# EAGLE design ArduIRv2 (EAGLE 7.2.0)
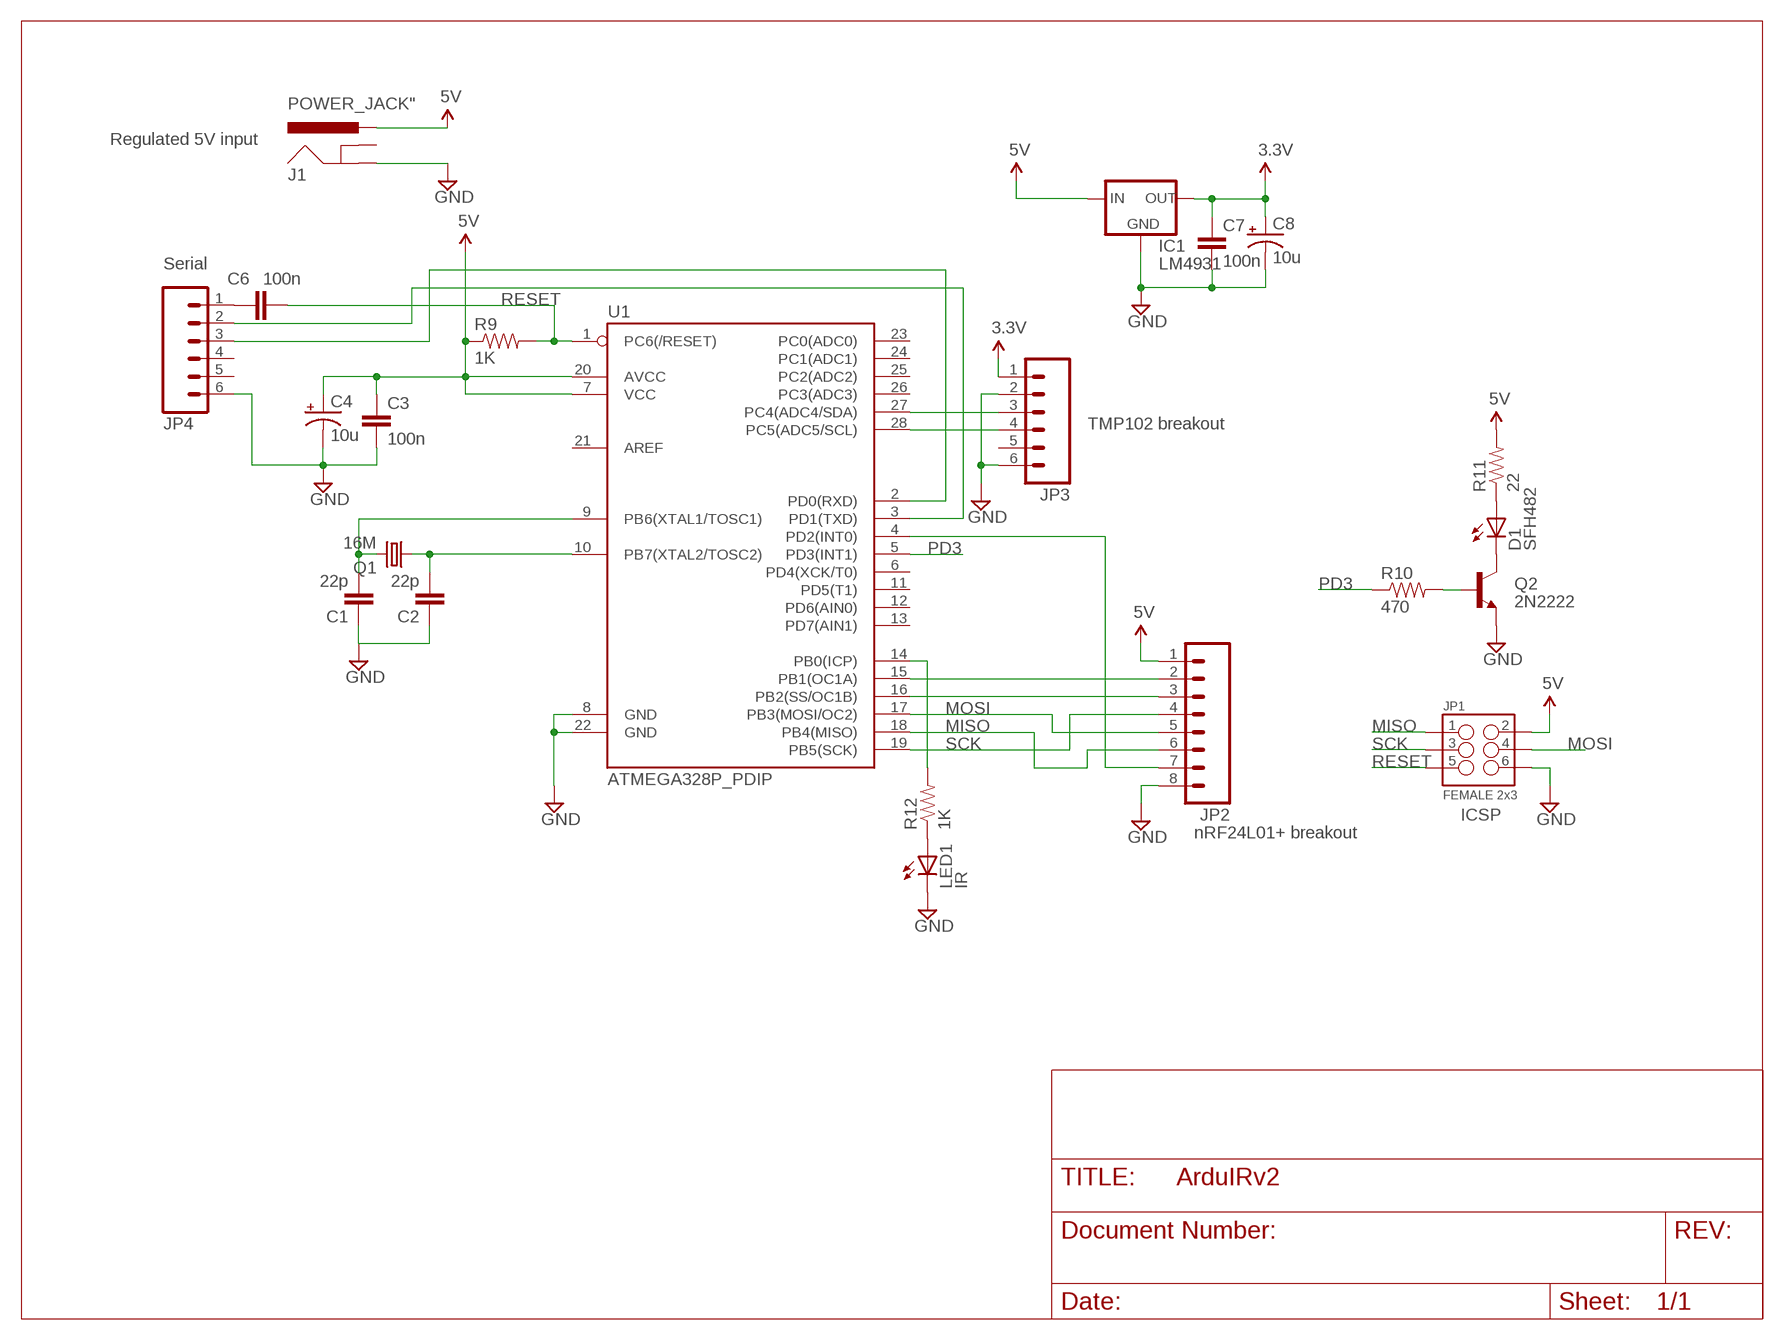
[diagram p0: schematic, sheet 1]

## Parts
C1  22p  CAPPTH  [CAP-PTH-SMALL]
C2  22p  CAPPTH  [CAP-PTH-SMALL]
C3  100n  0.1UF-50V-20%(PTH)KIT-EZ  [CAP-PTH-SMALL-KIT]
C4  10u  CAP_POLPTH2  [CPOL-RADIAL-10UF-25V]
C6  100n  0.1UF-50V-20%(PTH)KIT-EZ  [CAP-PTH-SMALL-KIT]
C7  100n  0.1UF-50V-20%(PTH)KIT-EZ  [CAP-PTH-SMALL-KIT]
C8  10u  CAP_POLPTH2  [CPOL-RADIAL-10UF-25V]
D1  SFH482  [SFH482]
IC1  LM4931  REGULATORTO220  [L4931_REGULATOR]
J1  POWER_JACK"  [POWER_JACK]
JP1  FEMALE 2x3  M03X2SHROUD  [2X3-SHROUDED]
JP2  M08SILK_FEMALE_PTH  [1X08]
JP3  M06SILK_FEMALE_PTH  [1X06]
JP4  M06SILK_FEMALE_PTH  [1X06]
LED1  IR  LED5MM  [LED5MM]
Q1  16M  CRYSTALHC49US  [HC49US]
Q2  2N2222  TRANSISTOR_NPNTO-92-AMMO  [TO-92-AMMO]
R9  1K  1KOHM-1/4W-1%(PTH)VERT-KIT  [AXIAL-0.1EZ]
R10  470  1KOHM-1/4W-1%(PTH)VERT-KIT  [AXIAL-0.1EZ]
R11  22  1KOHM-1/4W-1%(PTH)VERT-KIT  [AXIAL-0.1EZ]
R12  1K  10KOHM-1/4W-1%(PTH)VERT-KIT  [AXIAL-0.1EZ]
U1  ATMEGA328P_PDIP  [DIL28-3]

## Nets
3.3V: C7.1 C8.1(+) IC1.OUT JP3.1
5V: C3.1 C4.1(+) IC1.IN J1.PWR JP1.2 JP2.1 R9.P$1 R11.P$2 U1.7(VCC) U1.20(AVCC)
GND: C1.1 C2.1 C3.2 C4.2(-) C7.2 C8.2(-) IC1.GND J1.GND JP1.6 JP2.8 JP3.2 JP3.6 JP4.6 LED1.K(C) Q2.1(E) U1.8(GND) U1.22(GND)
MISO: JP1.1 JP2.6 U1.18(PB4(MISO))
MOSI: JP1.4 JP2.5 U1.17(PB3(MOSI/OC2))
N$1: JP2.2 U1.15(PB1(OC1A))
N$2: JP2.3 U1.16(PB2(SS/OC1B))
N$3: R12.P$2 U1.14(PB0(ICP))
N$4: JP2.7 U1.4(PD2(INT0))
N$10: C1.2 Q1.2 U1.9(PB6(XTAL1/TOSC1))
N$11: C2.2 Q1.1 U1.10(PB7(XTAL2/TOSC2))
N$13: JP3.3 U1.27(PC4(ADC4/SDA))
N$14: JP3.4 U1.28(PC5(ADC5/SCL))
N$15: Q2.2(B) R10.P$2
N$16: D1.K(C) Q2.3(C)
N$17: D1.A R11.P$1
N$18: LED1.A R12.P$1
N$22: C6.2 JP4.1
N$23: JP4.2 U1.3(PD1(TXD))
N$24: JP4.3 U1.2(PD0(RXD))
PD3: R10.P$1 U1.5(PD3(INT1))
RESET: C6.1 JP1.5 R9.P$2 U1.1(PC6(/RESET))
SCK: JP1.3 JP2.4 U1.19(PB5(SCK))
Unconnected: J1.GNDBREAK JP3.5 JP4.4 JP4.5 U1.6(PD4(XCK/T0)) U1.11(PD5(T1)) U1.12(PD6(AIN0)) U1.13(PD7(AIN1)) U1.21(AREF) U1.23(PC0(ADC0)) U1.24(PC1(ADC1)) U1.25(PC2(ADC2)) U1.26(PC3(ADC3))

## Notes on the sheet
- Regulated 5V input
- Serial
- TMP102 breakout
- ICSP
- nRF24L01+ breakout

## Library data of the parts
C1 C2 = SparkFun-Capacitors:CAP: Capacitor Standard 0603 ceramic capacitor, and 0.1" leaded capacitor.
C3 C6 C7 = SparkFun-Capacitors:0.1UF-50V-20%(PTH): CAP-08370; PROD_ID: CAP-08370
C4 C8 = SparkFun-Capacitors:CAP_POL: Capacitor Polarized These are standard SMD and PTH capacitors. Normally 10uF, 47uF, and 100uF in electrolytic and tantalum varieties. Always verify the external diameter of the through hole cap, it varies with capacity, voltage, and manufacturer. The EIA devices should be standard.
D1 = led:SFH482: IR LED infrared emitting diode, Infineon
IC1 = RBBB:REGULATOR: VOLTAGE REGULATOR
J1 = RBBB:POWER_JACK: Power Jack This is the standard 5.5mm barrel jack for power. The PTH is the most common, proven, reliable, footprint. All others are experimental. The Slot footprint only works if the mill layer is transmitted to the PCB fab house so be warned. Spark Fun Electronics SKU : PRT-00119. Mating wall wart : TOL-00298 (and others)
JP1 = SparkFun-Connectors:M03X2: 2x3 .1" header. Shrouded, with keying- CONN-10681 SMT- CONN-11415 Pogo pins- HW-11044; PROD_ID: CONN-10681
JP2 = SparkFun-Connectors:M08: Header 8 Standard 8-pin 0.1" header. Use with straight break away headers (SKU : PRT-00116), right angle break away headers (PRT-00553), swiss pins (PRT-00743), machine pins (PRT-00117), and female headers (PRT-00115).; PROD_ID: CONN-08438
JP3 JP4 = SparkFun-Connectors:M06: Header 6 Standard 6-pin 0.1" header. Use with straight break away headers (SKU : PRT-00116), right angle break away headers (PRT-00553), swiss pins (PRT-00743), machine pins (PRT-00117), and female headers (PRT-00115). Molex polarized connector foot print use with SKU : PRT-08094 with associated crimp pins and housings. NOTES ON THE VARIANTS LOCK and LOCK_LONGPADS... This footprint was designed to help hold the alignment of a through-hole component (i.e. 6-pin header) while soldering it into place. You may notice that each hole has been shifted either up or down by 0.005 of an inch from it's more standard position (which is a perfectly straight line). This slight alteration caused the pins (the squares in the middle) to touch the edges of the holes. Because they are alternating, it causes a "brace" to hold the component in place. 0.005 has proven to be the perfect amount of "off-center" position when using our standard breakaway headers. Although looks a little odd when you look at the bare footprint, once you have a header in there, the alteration is very hard to notice. Also,if you push a header all the way into place, it is covered up entirely on the bottom side. This idea of altering the position of holes to aid alignment will be further integrated into the Sparkfun Library for other footprints. It can help hold any component with 3 or more connection pins.; PROD_ID: CONN-08437
LED1 = led:LED: LED OSRAM: - CHIPLED LG R971, LG N971, LY N971, LG Q971, LY Q971, LO R971, LY R971 LH N974, LH R974 LS Q976, LO Q976, LY Q976 LO Q996 - Hyper CHIPLED LW Q18S LB Q993, LB Q99A, LB R99A - SideLED LS A670, LO A670, LY A670, LG A670, LP A670 LB A673, LV A673, LT A673, LW A673 LH A674 LY A675 LS A676, LA A676, LO A676, LY A676, LW A676 LS A679, LY A679, LG A679 - Hyper Micro SIDELED® LS Y876, LA Y876, LO Y876, LY Y876 LT Y87S - SmartLED LW L88C, LW L88S LB L89C, LB L89S, LG L890 LS L89K, LO L89K, LY L89K LS L896, LA L896, LO L896, LY L896 - TOPLED LS T670, LO T670, LY T670, LG T670, LP T670 LSG T670, LSP T670, LSY T670, LOP T670, LYG T670 LG T671, LOG T671, LSG T671 LB T673, LV T673, LT T673, LW T673 LH T674 LS T676, LA T676, LO T676, LY T676, LB T676, LH T676, LSB T676, LW T676 LB T67C, LV T67C, LT T67C, LS T67K, LO T67K, LY T67K, LW E67C LS E67B, LA E67B, LO E67B, LY E67B, LB E67C, LV E67C, LT E67C LW T67C LS T679, LY T679, LG T679 LS T770, LO T770, LY T770, LG T770, LP T770 LB T773, LV T773, LT T773, LW T773 LH T774 LS E675, LA E675, LY E675, LS T675 LS T776, LA T776, LO T776, LY T776, LB T776 LHGB T686 LT T68C, LB T68C - Hyper Mini TOPLED® LB M676 - Mini TOPLED Santana® LG M470 LS M47K, LO M47K, LY M47K Source: http://www.osram.convergy.de LUXEON: - LUMILED® LXK2-PW12-R00, LXK2-PW12-S00, LXK2-PW14-U00, LXK2-PW14-V00 LXK2-PM12-R00, LXK2-PM12-S00, LXK2-PM14-U00 LXK2-PE12-Q00, LXK2-PE12-R00, LXK2-PE12-S00, LXK2-PE14-T00, LXK2-PE14-U00 LXK2-PB12-K00, LXK2-PB12-L00, LXK2-PB12-M00, LXK2-PB14-N00, LXK2-PB14-P00, LXK2-PB14-Q00 LXK2-PR12-L00, LXK2-PR12-M00, LXK2-PR14-Q00, LXK2-PR14-R00 LXK2-PD12-Q00, LXK2-PD12-R00, LXK2-PD12-S00 LXK2-PH12-R00, LXK2-PH12-S00 LXK2-PL12-P00, LXK2-PL12-Q00, LXK2-PL12-R00 Source: www.luxeon.com KINGBRIGHT: KA-3528ASYC Source: www.kingbright.com
Q1 = SparkFun-FreqCtrl:CRYSTAL: Various standard crystals. Proven footprints.
Q2 = SparkFun-DiscreteSemi:TRANSISTOR_NPN: Generic NPN BJT MMBT2222A - TRANS-08049 (SOT-23, 1A 40V) MPSA42 - TRANS-09116 (SOT-23, 500mA 300V) MMBT5088LT1G - TRANS-11160 (SOT-23, 50 mA 30V) BC547 - COM-08928 <http://www.sparkfun.com/products/8928> (TO-92 45V 100mA) (1.Collector 2.Base 3.Emitter) 2N3904 - COM-00521 <http://www.sparkfun.com/products/521> (TO-92 40V 200mA) (1.Emitter 2.Base 3.Collector) P2N2222A - COM-12852 <http://www.sparkfun.com/products/12852> (TO-92 40V 600mA) (1.Collector 2.Base 3.Emitter)
R9 = SparkFun-Resistors:1KOHM-1/4W-1%(PTH): RES-12182; PROD_ID: RES-12182
R10 R11 = SparkFun-Resistors:1KOHM-1/4W-1%(PTH): RES-12182; PROD_ID: RES-12182; VALUE: 1K
R12 = SparkFun-Resistors:10KOHM-1/4W-1%(PTH): RES-12183; PROD_ID: RES-12183; VALUE: 10k
U1 = SparkFun-DigitalIC:ATMEGA328P_PDIP: uC used in the Arduino 32kb flash, 1k EEPROM, 2k SRAM This is the through-hole version of this chip.

## Board
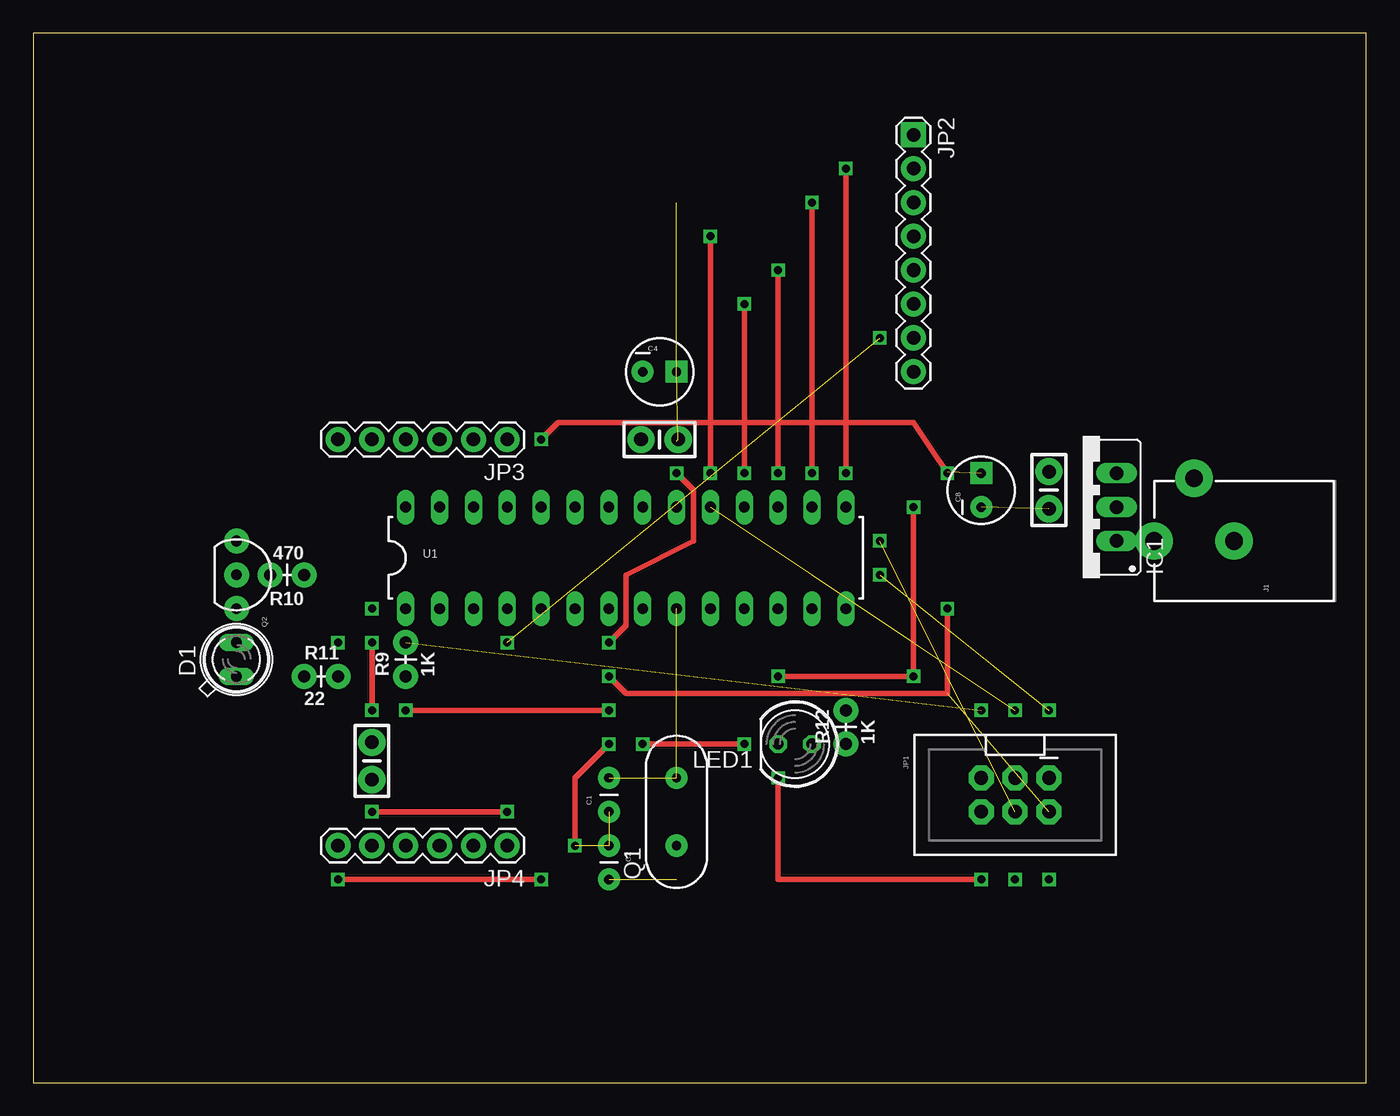
[diagram p1: board, top side]
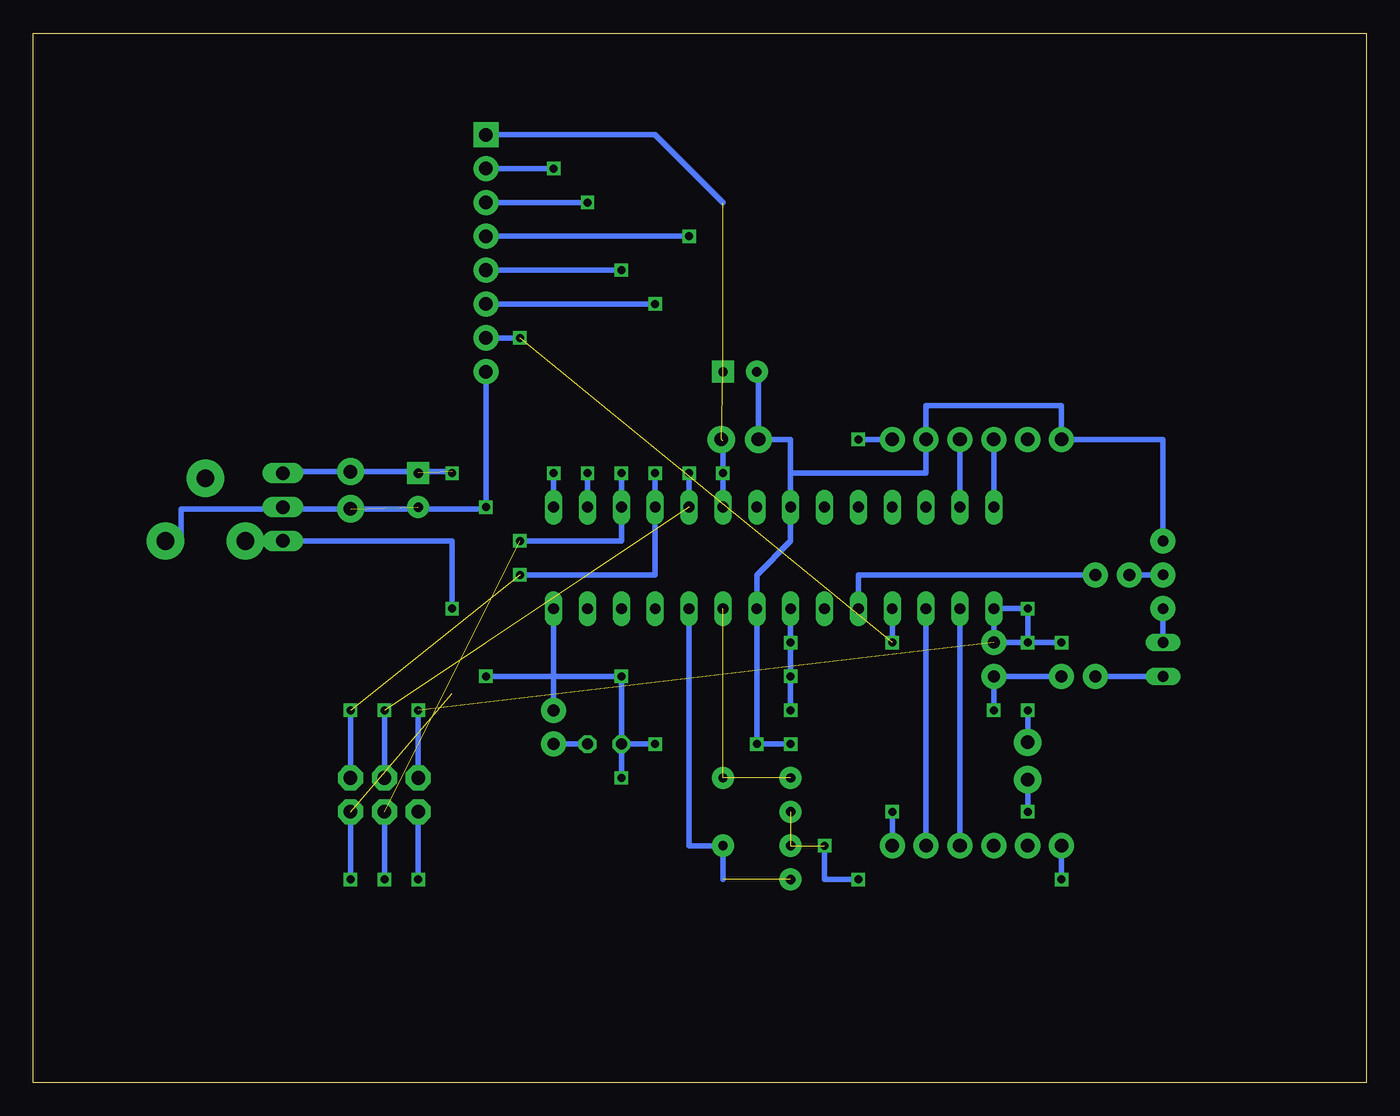
[diagram p2: board, bottom side, seen from below]

Size 100 x 78.73 mm. Coordinates in mm from the lower left corner, seen from the top.
Outline: 0,0 100,0 100,78.73 0,78.73 0,0
Copper layers (1*16): Top 0.035mm / dielectric 1.5mm / Bottom 0.035mm
Design rules "default": minimum track width 10mil, minimum drill 24mil, track to track 8mil, track to pad 8mil, pad to pad 8mil, via to via 8mil, smd to smd 8mil, copper to edge 40mil, drill to drill 8mil, minimum pad ring 10mil, minimum via ring 8mil, stop-mask expansion 4mil, vias tented up to drill 0mil, thermal gap 10mil

### Footprints (pad centres in the part's own frame; a part is rotated, then mirrored left to right if it is on the bottom)
CAP-PTH-SMALL = drill 0.7 pad 1.651: 1 0,0; 2 2.54,0
CAP-PTH-SMALL-KIT = drill 1.016 pad 2.032: 1 -1.397,0; 2 1.397,0
CPOL-RADIAL-10UF-25V = drill 0.7 pad 1.651 square: 1 1.27,0 | drill 0.7 pad 1.651: 2 -1.27,0
SFH482 = drill 0.813 long: A -1.27,0; K 1.27,0
L4931_REGULATOR = drill 1.016 long: GND 0,-2.54; IN -2.54,-2.54; OUT 2.54,-2.54
POWER_JACK = drill 1.321 pad 2.794: GND 0,7.7; GNDBREAK 4.7,10.7; PWR 0,13.7
2X3-SHROUDED = drill 1.016 pad 1.88 octagon: 1 -1.27,2.54; 2 1.27,2.54; 3 -1.27,0; 4 1.27,0; 5 -1.27,-2.54; 6 1.27,-2.54
1X08 = drill 1.016 pad 1.88 square: 1 0,0 | drill 1.016 pad 1.88: 2 2.54,0; 3 5.08,0; 4 7.62,0; 5 10.16,0; 6 12.7,0; 7 15.24,0; 8 17.78,0
1X06 = drill 1.016 pad 1.88: 1 0,0; 2 2.54,0; 3 5.08,0; 4 7.62,0; 5 10.16,0; 6 12.7,0
LED5MM = drill 0.813 octagon: A -1.27,0; K 1.27,0
HC49US = drill 0.7 pad 1.651: 1 -2.54,0; 2 2.54,0
TO-92-AMMO = drill 0.813 pad 1.88: 1 -2.54,0; 2 0,0; 3 2.54,0
AXIAL-0.1EZ = drill 0.9 pad 1.88: P$1 0,0; P$2 2.54,0
DIL28-3 = drill 0.813 long: 1 -16.51,-3.81; 2 -13.97,-3.81; 3 -11.43,-3.81; 4 -8.89,-3.81; 5 -6.35,-3.81; 6 -3.81,-3.81; 7 -1.27,-3.81; 8 1.27,-3.81; 9 3.81,-3.81; 10 6.35,-3.81; 11 8.89,-3.81; 12 11.43,-3.81; 13 13.97,-3.81; 14 16.51,-3.81; 15 16.51,3.81; 16 13.97,3.81; 17 11.43,3.81; 18 8.89,3.81; 19 6.35,3.81; 20 3.81,3.81; 21 1.27,3.81; 22 -1.27,3.81; 23 -3.81,3.81; 24 -6.35,3.81; 25 -8.89,3.81; 26 -11.43,3.81; 27 -13.97,3.81; 28 -16.51,3.81

### Placement (x,y rotation side)
C1  43.18,20.32 90 top
C2  43.18,17.78 270 top
C3  46.99,48.26 180 top
C4  46.99,53.34 0 top
C6  25.4,24.13 270 top
C7  76.2,44.45 270 top
C8  71.12,44.45 90 top
D1  15.24,31.75 90 top
IC1  78.74,43.18 90 top
J1  97.79,40.64 90 top
JP1  73.66,21.59 270 top
JP2  66.04,71.12 270 top
JP3  35.56,48.26 180 top
JP4  35.56,17.78 180 top
LED1  57.15,25.4 180 top
Q1  48.26,20.32 90 top
Q2  15.24,38.1 270 top
R9  27.94,30.48 90 top
R10  20.32,38.1 180 top
R11  20.32,30.48 0 top
R12  60.96,25.4 90 top
U1  44.45,39.37 0 top

### Tracks (layer width: path | path; a pad name or v marks a point on that pad's centre or on a via)
3.3V  (via drill 0.6)  (1 unrouted)
  Top 0.406: v68.58,45.72 66.04,49.53 39.37,49.53 v38.1,48.26
  Bottom 0.406: v38.1,48.26 JP3.1 | v68.58,45.72 68.58,45.85 C7.1 81.28,45.85 IC1.OUT
5V  (via drill 0.6)  (4 unrouted)
  Top 0.406: v43.18,27.94 v27.94,27.94 | v43.18,33.02 44.45,34.29 44.45,38.1 49.53,40.64 49.53,44.45 v48.26,45.72 | v43.18,30.48 44.45,29.21 68.58,29.21 v68.58,35.56
  Bottom 0.406: v43.18,27.94 v43.18,30.48 v43.18,33.02 U1.7 | v27.94,27.94 R9.P$1 R11.P$2 | 48.26,48.13 v48.26,45.72 U1.20 | J1.PWR IC1.IN 68.58,40.64 v68.58,35.56 | JP1.2 v76.2,15.24 | 48.26,66.04 53.34,71.12 JP2.1
GND  (via drill 0.6)  (3 unrouted)
  Top 0.406: v53.34,25.4 v45.72,25.4 | v43.18,25.4 40.64,22.86 v40.64,17.78 | v55.88,30.48 v66.04,30.48 v66.04,43.18 | v38.1,15.24 v22.86,15.24 | v55.88,22.86 55.88,15.24 v71.12,15.24
  Bottom 0.406: 43.18,45.72 33.02,45.72 JP3.2 33.02,50.8 22.86,50.8 JP3.6 15.24,48.26 Q2.1 | 43.18,45.72 U1.22 43.18,40.64 45.72,38.1 U1.8 v45.72,25.4 v43.18,25.4 | 45.72,48.26 C3.2 | C3.2 43.18,48.26 43.18,45.72 | v22.86,15.24 JP4.6 | C3.2 45.59,53.21 C4.2 | LED1.K v53.34,25.4 | LED1.K v55.88,30.48 | v38.1,15.24 40.64,15.24 v40.64,17.78 | JP1.6 v71.12,15.24 | LED1.K v55.88,22.86 v55.88,30.48 | JP2.8 v66.04,43.18 66.04,43.05 C7.2 81.28,43.05 | 81.28,43.05 IC1.GND | 81.28,43.05 88.9,43.05 88.9,40.64 J1.GND | v66.04,30.48 v55.88,30.48
MISO  (via drill 0.6)  (1 unrouted)
  Top 0.406: v53.34,58.42 v53.34,45.72
  Bottom 0.406: v63.5,38.1 53.34,38.1 U1.18 v53.34,45.72 | v76.2,27.94 JP1.1 | JP2.6 v53.34,58.42
MOSI  (via drill 0.6)  (1 unrouted)
  Top 0.406: v55.88,60.96 v55.88,45.72
  Bottom 0.406: v63.5,40.64 55.88,40.64 U1.17 v55.88,45.72 | v73.66,15.24 JP1.4 | JP2.5 v55.88,60.96
N$1  (via drill 0.6)
  Top 0.406: v60.96,68.58 v60.96,45.72
  Bottom 0.406: JP2.2 v60.96,68.58 | v60.96,45.72 U1.15
N$2  (via drill 0.6)
  Top 0.406: v58.42,66.04 v58.42,45.72
  Bottom 0.406: JP2.3 v58.42,66.04 | v58.42,45.72 U1.16
N$3
  Bottom 0.406: U1.14 R12.P$2
N$4  (via drill 0.6)  (1 unrouted)
  Bottom 0.406: JP2.7 v63.5,55.88 | U1.4 v35.56,33.02
N$10  (2 unrouted)
N$11  (1 unrouted)
  Bottom 0.406: U1.10 50.8,17.78 Q1.1 48.26,15.24
N$13
  Bottom 0.406: U1.27 JP3.3
N$14
  Bottom 0.406: JP3.4 U1.28
N$15
  Bottom 0.406: Q2.2 R10.P$2
N$16
  Bottom 0.406: D1.K Q2.3
N$17
  Bottom 0.406: R11.P$1 D1.A
N$18
  Bottom 0.406: LED1.A R12.P$1
N$22  (via drill 0.6)
  Top 0.406: v35.56,20.32 v25.4,20.32
  Bottom 0.406: JP4.1 v35.56,20.32 | v25.4,20.32 C6.2
N$23
  Bottom 0.406: JP4.2 U1.3
N$24
  Bottom 0.406: JP4.3 U1.2
PD3
  Bottom 0.406: R10.P$1 38.1,38.1 U1.5
RESET  (via drill 0.6)  (1 unrouted)
  Top 0.406: v25.4,27.94 v25.4,33.02
  Bottom 0.406: R9.P$2 U1.1 v25.4,35.56 v25.4,33.02 R9.P$2 | C6.1 v25.4,27.94 | R9.P$2 v22.86,33.02 | JP1.5 v71.12,27.94
SCK  (via drill 0.6)  (1 unrouted)
  Top 0.406: v50.8,63.5 v50.8,45.72
  Bottom 0.406: JP1.3 v73.66,27.94 | JP2.4 v50.8,63.5 | v50.8,45.72 U1.19